# Altium schematic sheet light_humid.SchDoc
size Tabloid
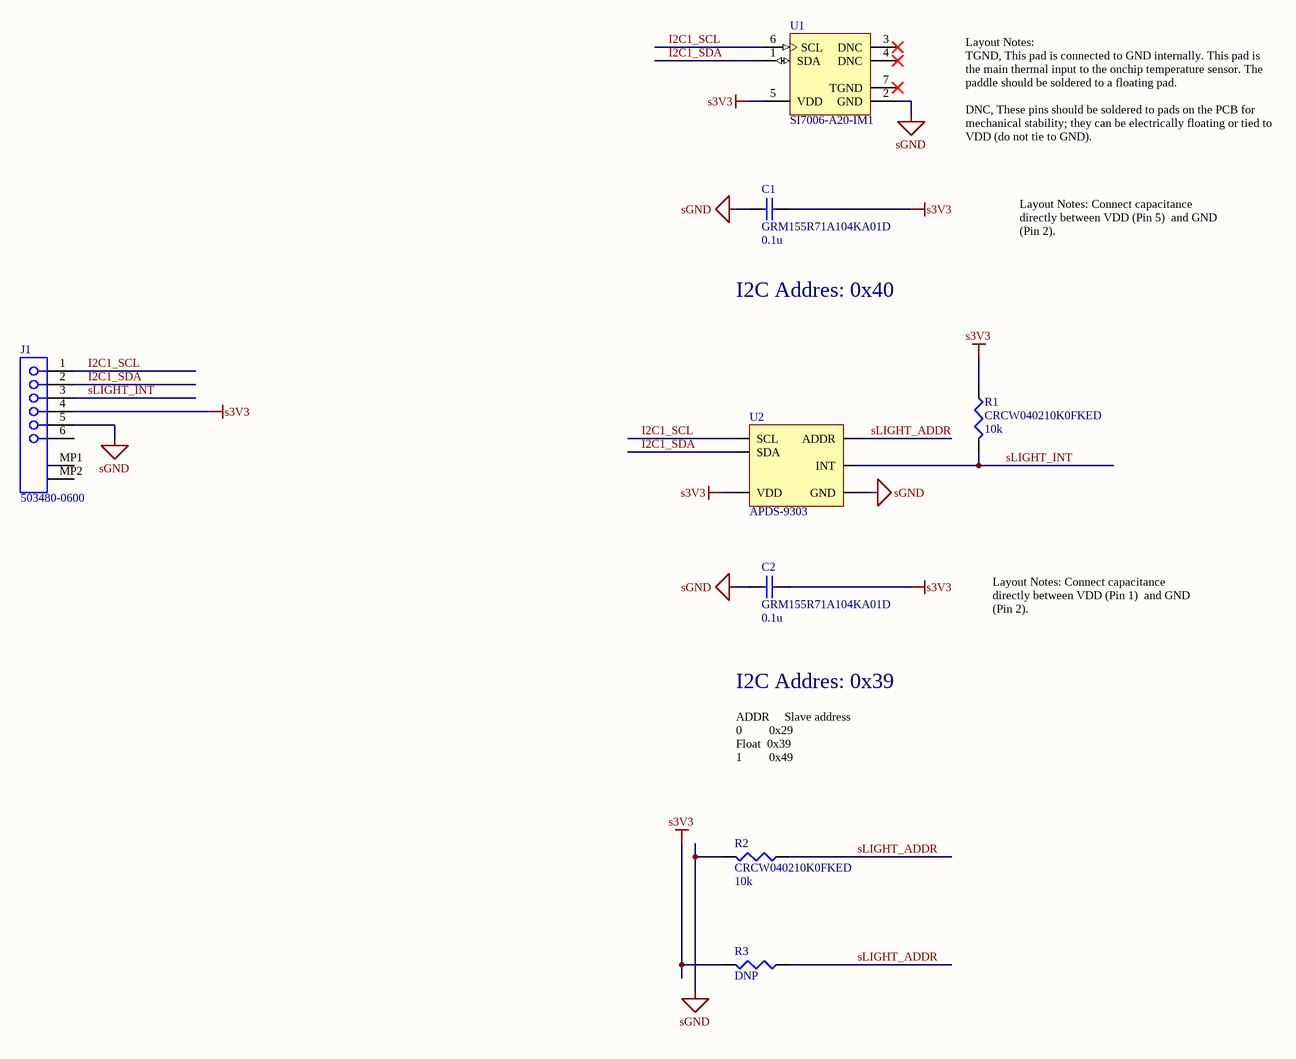
[diagram p0: light_humid.SchDoc]

## Parts
C1  GRM155R71A104KA01D  value 0.1u  [0402]
C2  GRM155R71A104KA01D  value 0.1u  [0402]
J1  503480-0600  [MOLX-503480-0600]
R1  CRCW040210K0FKED  value 10k  [0402]
R2  CRCW040210K0FKED  value 10k  [0402]
R3  DNP  [0402]
U1  SI7006-A20-IM1  [SLAB-DFN-6-1500X2400TP_V]
U2  APDS-9303  [APDS-9303]

## Nets
s3V3: C1.2 C2.2 J1.4 R1.1 R3.2 U1.5(VDD) U2.1(VDD)
sGND: C1.1 C2.1 J1.5 R2.2 U1.2(GND) U2.2(GND)
I2C1_SCL: J1.1 U1.6(SCL) U2.4(SCL)
I2C1_SDA: J1.2 U1.1(SDA) U2.5(SDA)
sLIGHT_ADDR: R2.1 R3.1 U2.3(ADDR)
sLIGHT_INT: J1.3 R1.2 U2.6(INT)

Not connected (* = marked no-connect by the designer): J1 6 MP1 MP2; U1 3(DNC)* 4(DNC)* 7(TGND)*

## Notes on the sheet
- Layout Notes:
  TGND, This pad is connected to GND internally. This pad is the main thermal input to the onchip temperature sensor. The paddle should be soldered to a floating pad.
  DNC, These pins should be soldered to pads on the PCB for mechanical stability; they can be electrically floating or tied to VDD (do not tie to GND).
- Layout Notes: Connect capacitance directly between VDD (Pin 5)  and GND (Pin 2).
- I2C Addres: 0x40
- Layout Notes: Connect capacitance directly between VDD (Pin 1)  and GND (Pin 2).
- I2C Addres: 0x39
- ADDR     Slave address
  0         0x29
  Float  0x39
  1         0x49

## Library data of the parts
C1 C2 = GRM155R71AxxxKdddd: -55-125C, 1005, 10V, X7R, ±10%
J1 = CMP-1241-00113-1: 0.5 mm Pitch Easy-On(TM) BackFlip(TM) Type FPC Connector, 1.0 mm Mated Height, Right Angle, SMT, Dual Contact, 6 Circuits, -40 to 85 degC, ELV and RoHS Compliant, Tape and Reel; Manufacturer: Molex; Durability (mating cycles max): 10; Voltage (Max): 50V AC (RMS)/DC; PCB Retention: Yes; Material - Plating Termination: Gold, Tin; Mated Height: 1.00mm; Circuits (Loaded): 6; PCB Locator: No; Entry Angle: 90degrees Angle; Current (Max per Contact): 0.5A; Material - Metal: Phosphor Bronze; Pitch - Mating Interface: 0.50mm; Material - Plating Mating: Gold; ComponentLink3Description: Package Specification; Orientation: Right Angle; RoHS: TRUE; ComponentLink1URL: http://www.molex.com/molex/index.jsp; PackageVersion: Rev. F, 09/2012; Packing: Tape and Reel; PackageDescription: 6-Lead FPC Connector, Pitch 0.5 mm; Polarized to PCB: Yes; Number of Rows: 1; ComponentLink2URL: http://www.molex.com/webdocs/datasheets/pdf/en-us/5034800600_FFC_FPC_CONNECTORS.pdf; PackageReference: 503480-0600; Contact Position: Dual; PartNumber: 503480-0600; ComponentLink3URL: http://www.molex.com/pdm_docs/sd/5034800600_sd.pdf; ComponentLink2Description: Datasheet; Mounting Technology: Surface Mount; ComponentLink1Description: Manufacturer URL; Stackable: No
R1 R2 = CRCW0402xxxxFKED: 0.125W, -55-155C, 1005, 50V, ±1%
R3 = CRCW0402xxxxFKED: 0.125W, -55-155C, 1005, 50V, ±1%; Value: 10k
U1 = CMP-2000-07060-1: I2C Humidity and Temperature Sensor, 1.9 to 3.6 V, -40 to 125 degC, 6-Pin DFN, RoHS, Tube; Manufacturer: Silicon Labs; Output Type: Digital; Resolution: 12(Humidity)bit,14(Temperature)bit; Minimum Operating Supply Voltage: 1.9V; Sensor Function: Temperature&Humidity; Accuracy: ±1°C,±5%RH; Maximum Operating Supply Voltage: 3.6V; Pin Count: 6; Maximum Operating Temperature: +125°C; Package Reference: DFN-6; Height: 0.75mm; Datasheet URL: https://www.silabs.com/Support%20Documents%2FTechnicalDocs%2FSi7006-A20.pdf; Datasheet Version: Rev. 1.1, 06/2015; Package Type: DFN; Mounting Technology: SurfaceMount; Dimensions: 3x3x0.75mm; Length: 3mm; Package Description: 6-Pin Small Outline No-Lead Package, Body 3 x 3 mm, Pitch 1 mm; Minimum Operating Temperature: -40°C; Interface Type: I2C; Mounting Type: SurfaceMount; Width: 3mm; Manufacturer URL: http://www.silabs.com/